# Altium schematic sheet MCU.SchDoc
size A3
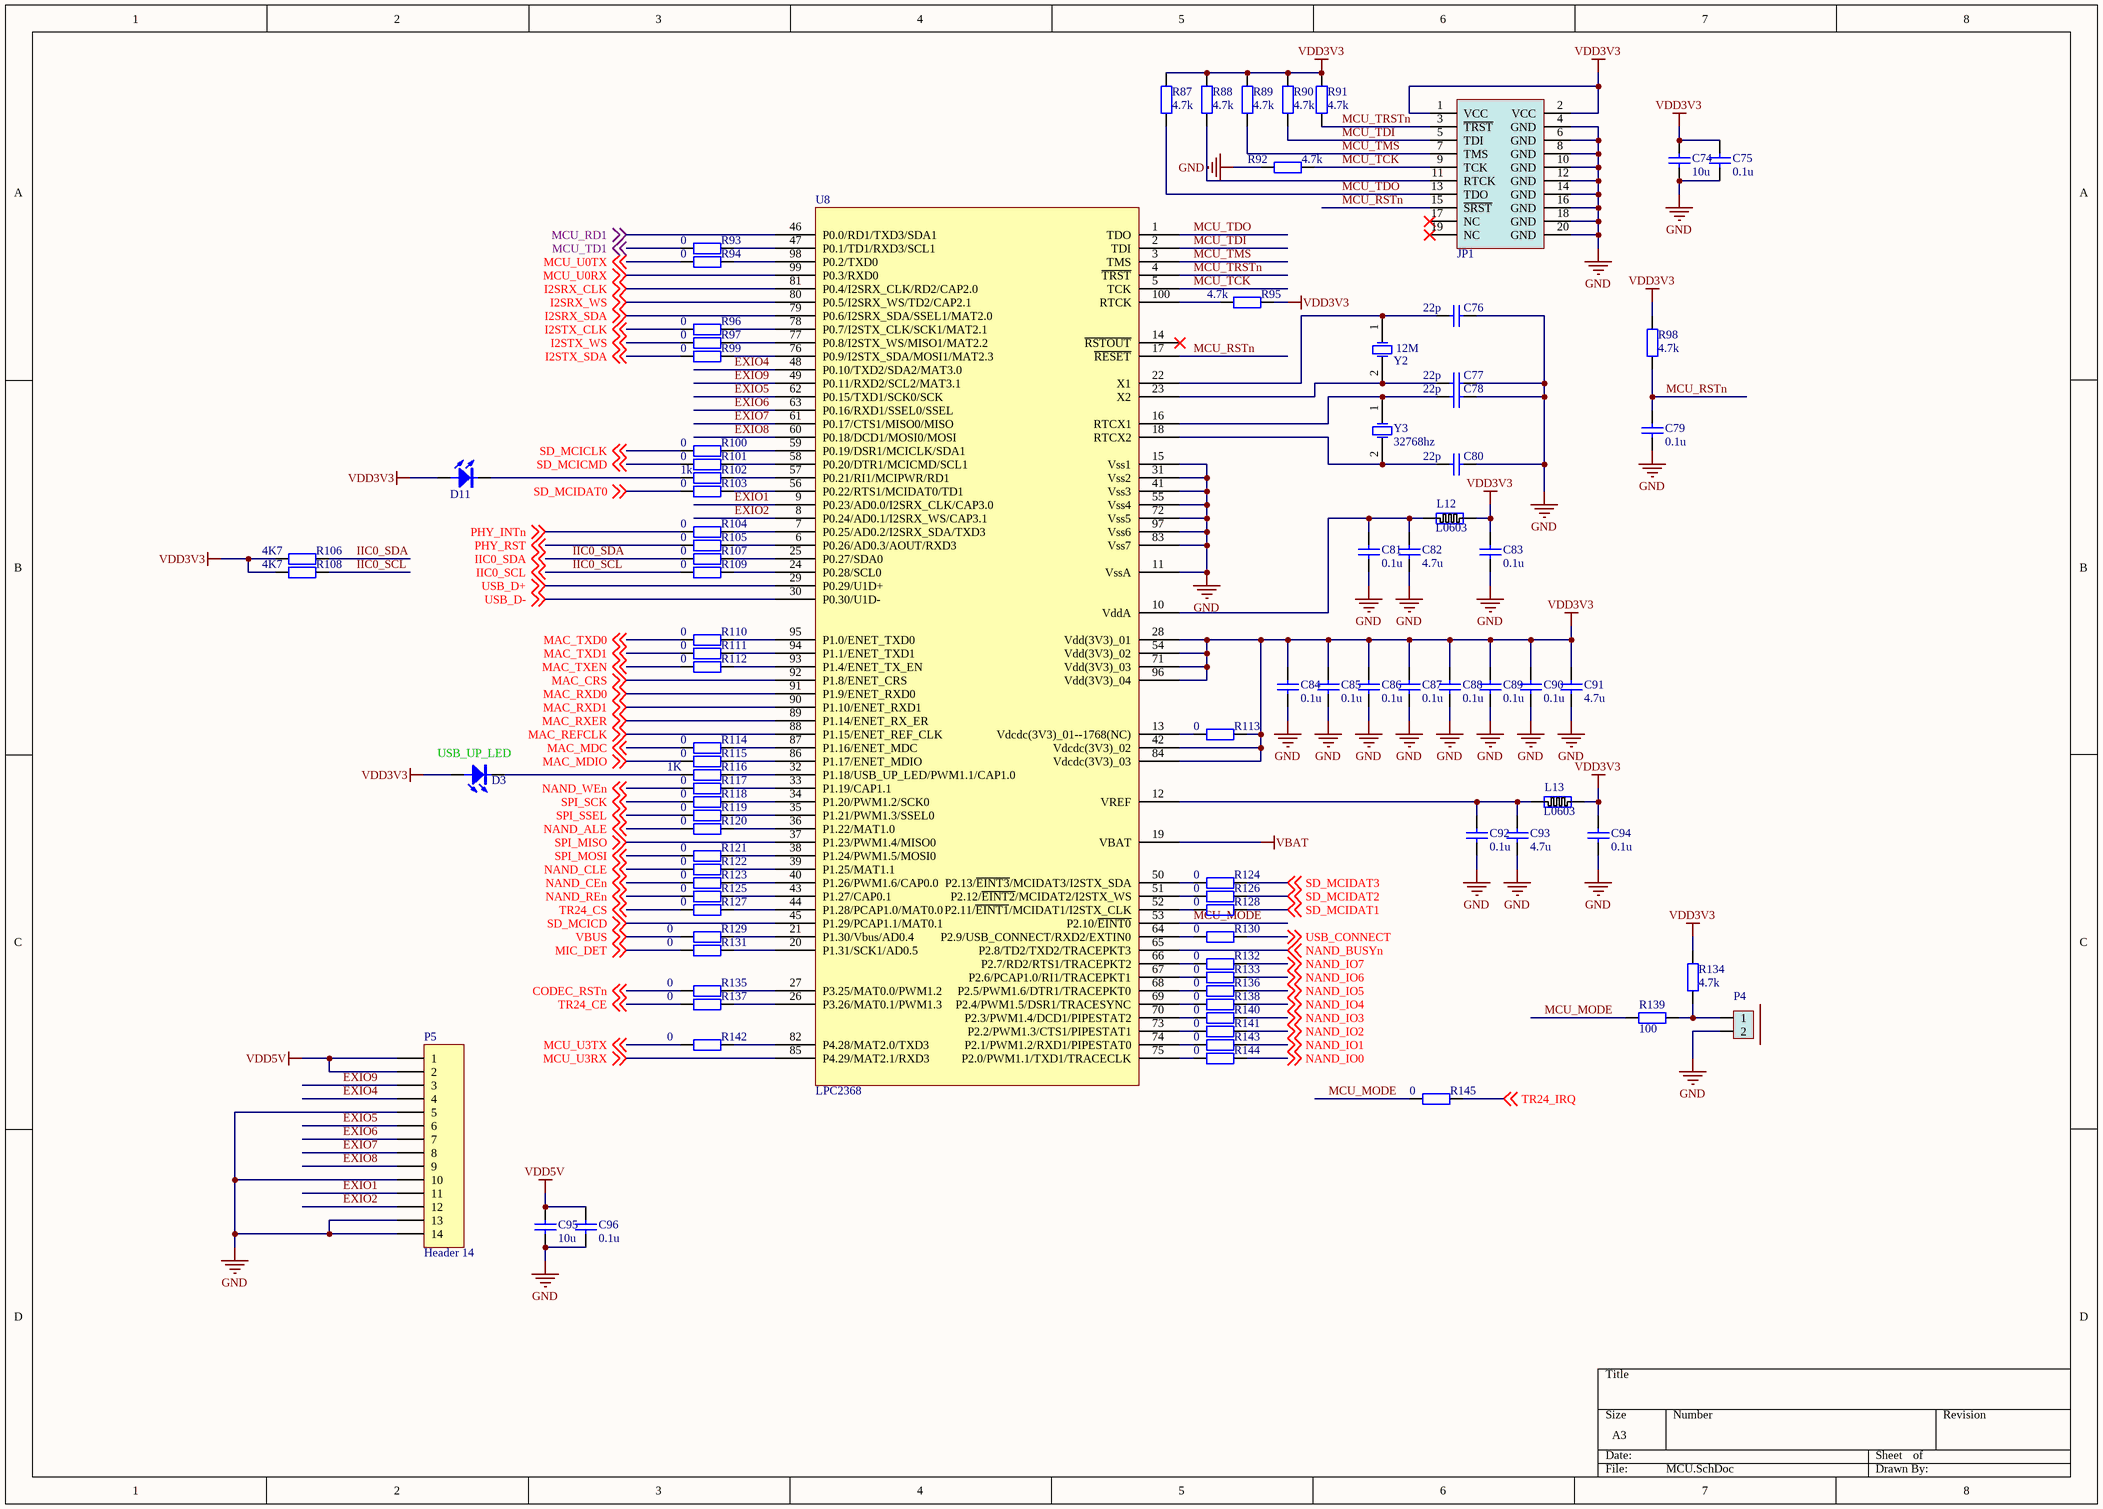
[diagram p0: MCU.SchDoc]

## Parts
C74  10u  [C0603]
C75  0.1u  [C0603]
C76  22p  [C0603]
C77  22p  [C0603]
C78  22p  [C0603]
C79  0.1u  [C0603]
C80  22p  [C0603]
C81  0.1u  [C0603]
C82  4.7u  [C0603]
C83  0.1u  [C0603]
C84  0.1u  [C0603]
C85  0.1u  [C0603]
C86  0.1u  [C0603]
C87  0.1u  [C0603]
C88  0.1u  [C0603]
C89  0.1u  [C0603]
C90  0.1u  [C0603]
C91  4.7u  [C0603]
C92  0.1u  [C0603]
C93  4.7u  [C0603]
C94  0.1u  [C0603]
C95  10u  [C0603]
C96  0.1u  [C0603]
D3  LED_SMT  [LED0805]  (value not drawn)
D11  LED_SMT  [LED0805]  (value not drawn)
JP1  JTAG20  [IDC-20(2.54)IDE]  (value not drawn)
L12  L0603  [L0603]
L13  L0603  [L0603]
P4  PIN  [SIP2]  (value not drawn)
P5  Header 14  [HDR1X14]
R87  4.7k  [R0603]
R88  4.7k  [R0603]
R89  4.7k  [R0603]
R90  4.7k  [R0603]
R91  4.7k  [R0603]
R92  4.7k  [R0603]
R93  0  [R0603]
R94  0  [R0603]
R95  4.7k  [R0603]
R96  0  [R0603]
R97  0  [R0603]
R98  4.7k  [R0603]
R99  0  [R0603]
R100  0  [R0603]
R101  0  [R0603]
R102  1k  [R0603]
R103  0  [R0603]
R104  0  [R0603]
R105  0  [R0603]
R106  4K7  [R0603]
R107  0  [R0603]
R108  4K7  [R0603]
R109  0  [R0603]
R110  0  [R0603]
R111  0  [R0603]
R112  0  [R0603]
R113  0  [R0603]
R114  0  [R0603]
R115  0  [R0603]
R116  1K  [R0603]
R117  0  [R0603]
R118  0  [R0603]
R119  0  [R0603]
R120  0  [R0603]
R121  0  [R0603]
R122  0  [R0603]
R123  0  [R0603]
R124  0  [R0603]
R125  0  [R0603]
R126  0  [R0603]
R127  0  [R0603]
R128  0  [R0603]
R129  0  [R0603]
R130  0  [R0603]
R131  0  [R0603]
R132  0  [R0603]
R133  0  [R0603]
R134  4.7k  [R0603]
R135  0  [R0603]
R136  0  [R0603]
R137  0  [R0603]
R138  0  [R0603]
R139  100  [R0603]
R140  0  [R0603]
R141  0  [R0603]
R142  0  [R0603]
R143  0  [R0603]
R144  0  [R0603]
R145  0  [R0603]
U8  LPC2368  [QFP100-I20-605605]
Y2  12M  [XTAL-SMD-LP]
Y3  32768hz  [XTAL32768]

## Nets
GND: C74.1 C75.1 C76.1 C77.1 C78.1 C79.1 C80.1 C81.1 C82.1 C83.1 C84.1 C85.1 C86.1 C87.1 C88.1 C89.1 C90.1 C91.1 C92.1 C93.1 C94.1 C95.1 C96.1 JP1.4(GND) JP1.6(GND) JP1.8(GND) JP1.10(GND) JP1.12(GND) JP1.14(GND) JP1.16(GND) JP1.18(GND) JP1.20(GND) P4.2 P5.5 P5.10 P5.13 P5.14 R92.2 U8.11(VssA) U8.15(Vss1) U8.31(Vss2) U8.41(Vss3) U8.55(Vss4) U8.72(Vss5) U8.83(Vss7) U8.97(Vss6)
VBAT: U8.19(VBAT)
VDD3V3: C74.2 C75.2 C83.2 C84.2 C85.2 C86.2 C87.2 C88.2 C89.2 C90.2 C91.2 C94.2 D3.A D11.A JP1.1(VCC) JP1.2(VCC) L12.2 L13.2 R87.2 R88.2 R89.2 R90.2 R91.2 R95.2 R98.2 R106.2 R108.2 R113.2 R134.2 U8.28(Vdd(3V3)_01) U8.42(Vdcdc(3V3)_02) U8.54(Vdd(3V3)_02) U8.71(Vdd(3V3)_03) U8.84(Vdcdc(3V3)_03) U8.96(Vdd(3V3)_04)
VDD5V: C95.2 C96.2 P5.1 P5.2
CODEC_RSTn: R135.1 ; off-sheet CODEC_RSTn
EXIO1: P5.11 U8.9(P0.23/AD0.0/I2SRX_CLK/CAP3.0)
EXIO2: P5.12 U8.8(P0.24/AD0.1/I2SRX_WS/CAP3.1)
EXIO4: P5.4 U8.48(P0.10/TXD2/SDA2/MAT3.0)
EXIO5: P5.6 U8.62(P0.15/TXD1/SCK0/SCK)
EXIO6: P5.7 U8.63(P0.16/RXD1/SSEL0/SSEL)
EXIO7: P5.8 U8.61(P0.17/CTS1/MISO0/MISO)
EXIO8: P5.9 U8.60(P0.18/DCD1/MOSI0/MOSI)
EXIO9: P5.3 U8.49(P0.11/RXD2/SCL2/MAT3.1)
I2SRX_CLK: U8.81(P0.4/I2SRX_CLK/RD2/CAP2.0) ; off-sheet I2SRX_CLK
I2SRX_SDA: U8.79(P0.6/I2SRX_SDA/SSEL1/MAT2.0) ; off-sheet I2SRX_SDA
I2SRX_WS: U8.80(P0.5/I2SRX_WS/TD2/CAP2.1) ; off-sheet I2SRX_WS
I2STX_CLK: R96.1 ; off-sheet I2STX_CLK
I2STX_SDA: R99.1 ; off-sheet I2STX_SDA
I2STX_WS: R97.1 ; off-sheet I2STX_WS
IIC0_SCL: R108.1 R109.1 ; off-sheet IIC0_SCL
IIC0_SDA: R106.1 R107.1 ; off-sheet IIC0_SDA
MAC_CRS: U8.92(P1.8/ENET_CRS) ; off-sheet MAC_CRS
MAC_MDC: R114.1 ; off-sheet MAC_MDC
MAC_MDIO: R115.1 ; off-sheet MAC_MDIO
MAC_REFCLK: U8.88(P1.15/ENET_REF_CLK) ; off-sheet MAC_REFCLK
MAC_RXD0: U8.91(P1.9/ENET_RXD0) ; off-sheet MAC_RXD0
MAC_RXD1: U8.90(P1.10/ENET_RXD1) ; off-sheet MAC_RXD1
MAC_RXER: U8.89(P1.14/ENET_RX_ER) ; off-sheet MAC_RXER
MAC_TXD0: R110.1 ; off-sheet MAC_TXD0
MAC_TXD1: R111.1 ; off-sheet MAC_TXD1
MAC_TXEN: R112.1 ; off-sheet MAC_TXEN
MCU_MODE: R139.2 R145.1 U8.53(P2.10/~{EINT0})
MCU_RD1: U8.46(P0.0/RD1/TXD3/SDA1) ; off-sheet MCU_RD1
MCU_RSTn: C79.2 JP1.15(~{SRST}) R98.1 U8.17(~{RESET})
MCU_TCK: JP1.9(TCK) R92.1 U8.5(TCK)
MCU_TD1: R93.1 ; off-sheet MCU_TD1
MCU_TDI: JP1.5(TDI) R90.1 U8.2(TDI)
MCU_TDO: JP1.13(TDO) R87.1 U8.1(TDO)
MCU_TMS: JP1.7(TMS) R89.1 U8.3(TMS)
MCU_TRSTn: JP1.3(~{TRST}) R91.1 U8.4(~{TRST})
MCU_U0RX: U8.99(P0.3/RXD0) ; off-sheet MCU_U0RX
MCU_U0TX: R94.1 ; off-sheet MCU_U0TX
MCU_U3RX: U8.85(P4.29/MAT2.1/RXD3) ; off-sheet MCU_U3RX
MCU_U3TX: R142.1 ; off-sheet MCU_U3TX
MIC_DET: R131.1 ; off-sheet MIC_DET
NAND_ALE: R120.1 ; off-sheet NAND_ALE
NAND_BUSYn: U8.65(P2.8/TD2/TXD2/TRACEPKT3) ; off-sheet NAND_BUSYn
NAND_CEn: R123.1 ; off-sheet NAND_CEn
NAND_CLE: R122.1 ; off-sheet NAND_CLE
NAND_IO0: R144.2 ; off-sheet NAND_IO0
NAND_IO1: R143.2 ; off-sheet NAND_IO1
NAND_IO2: R141.2 ; off-sheet NAND_IO2
NAND_IO3: R140.2 ; off-sheet NAND_IO3
NAND_IO4: R138.2 ; off-sheet NAND_IO4
NAND_IO5: R136.2 ; off-sheet NAND_IO5
NAND_IO6: R133.2 ; off-sheet NAND_IO6
NAND_IO7: R132.2 ; off-sheet NAND_IO7
NAND_REn: R125.1 ; off-sheet NAND_REn
NAND_WEn: R117.1 ; off-sheet NAND_WEn
PHY_INTn: R104.1 ; off-sheet PHY_INTn
PHY_RST: R105.1 ; off-sheet PHY_RST
SD_MCICD: U8.45(P1.29/PCAP1.1/MAT0.1) ; off-sheet SD_MCICD
SD_MCICLK: R100.1 ; off-sheet SD_MCICLK
SD_MCICMD: R101.1 ; off-sheet SD_MCICMD
SD_MCIDAT0: R103.1 ; off-sheet SD_MCIDAT0
SD_MCIDAT1: R128.2 ; off-sheet SD_MCIDAT1
SD_MCIDAT2: R126.2 ; off-sheet SD_MCIDAT2
SD_MCIDAT3: R124.2 ; off-sheet SD_MCIDAT3
SPI_MISO: U8.37(P1.23/PWM1.4/MISO0) ; off-sheet SPI_MISO
SPI_MOSI: R121.1 ; off-sheet SPI_MOSI
SPI_SCK: R118.1 ; off-sheet SPI_SCK
SPI_SSEL: R119.1 ; off-sheet SPI_SSEL
TR24_CE: R137.1 ; off-sheet TR24_CE
TR24_CS: R127.1 ; off-sheet TR24_CS
TR24_IRQ: R145.2 ; off-sheet TR24_IRQ
USB_CONNECT: R130.2 ; off-sheet USB_CONNECT
USB_D+: U8.29(P0.29/U1D+) ; off-sheet USB_D+
USB_D-: U8.30(P0.30/U1D-) ; off-sheet USB_D-
VBUS: R129.1 ; off-sheet VBUS
NetC76_2: C76.2 U8.22(X1) Y2.1(OSC1)
NetC77_2: C77.2 U8.23(X2) Y2.2(OSC2)
NetC78_2: C78.2 U8.16(RTCX1) Y3.1(OSC1)
NetC80_2: C80.2 U8.18(RTCX2) Y3.2(OSC2)
NetC81_2: C81.2 C82.2 L12.1 U8.10(VddA)
NetC92_2: C92.2 C93.2 L13.1 U8.12(VREF)
NetD3_K: D3.K R116.1
NetD11_K: D11.K R102.1
NetJP1_11: JP1.11(RTCK) R88.1
NetP4_1: P4.1 R134.1 R139.1
NetR93_2: R93.2 U8.47(P0.1/TD1/RXD3/SCL1)
NetR94_2: R94.2 U8.98(P0.2/TXD0)
NetR95_1: R95.1 U8.100(RTCK)
NetR96_2: R96.2 U8.78(P0.7/I2STX_CLK/SCK1/MAT2.1)
NetR97_2: R97.2 U8.77(P0.8/I2STX_WS/MISO1/MAT2.2)
NetR99_2: R99.2 U8.76(P0.9/I2STX_SDA/MOSI1/MAT2.3)
NetR100_2: R100.2 U8.59(P0.19/DSR1/MCICLK/SDA1)
NetR101_2: R101.2 U8.58(P0.20/DTR1/MCICMD/SCL1)
NetR102_2: R102.2 U8.57(P0.21/RI1/MCIPWR/RD1)
NetR103_2: R103.2 U8.56(P0.22/RTS1/MCIDAT0/TD1)
NetR104_2: R104.2 U8.7(P0.25/AD0.2/I2SRX_SDA/TXD3)
NetR105_2: R105.2 U8.6(P0.26/AD0.3/AOUT/RXD3)
NetR107_2: R107.2 U8.25(P0.27/SDA0)
NetR109_2: R109.2 U8.24(P0.28/SCL0)
NetR110_2: R110.2 U8.95(P1.0/ENET_TXD0)
NetR111_2: R111.2 U8.94(P1.1/ENET_TXD1)
NetR112_2: R112.2 U8.93(P1.4/ENET_TX_EN)
NetR113_1: R113.1 U8.13(Vdcdc(3V3)_01--1768(NC))
NetR114_2: R114.2 U8.87(P1.16/ENET_MDC)
NetR115_2: R115.2 U8.86(P1.17/ENET_MDIO)
NetR116_2: R116.2 U8.32(P1.18/USB_UP_LED/PWM1.1/CAP1.0)
NetR117_2: R117.2 U8.33(P1.19/CAP1.1)
NetR118_2: R118.2 U8.34(P1.20/PWM1.2/SCK0)
NetR119_2: R119.2 U8.35(P1.21/PWM1.3/SSEL0)
NetR120_2: R120.2 U8.36(P1.22/MAT1.0)
NetR121_2: R121.2 U8.38(P1.24/PWM1.5/MOSI0)
NetR122_2: R122.2 U8.39(P1.25/MAT1.1)
NetR123_2: R123.2 U8.40(P1.26/PWM1.6/CAP0.0)
NetR124_1: R124.1 U8.50(P2.13/~{EINT3}/MCIDAT3/I2STX_SDA)
NetR125_2: R125.2 U8.43(P1.27/CAP0.1)
NetR126_1: R126.1 U8.51(P2.12/~{EINT2}/MCIDAT2/I2STX_WS)
NetR127_2: R127.2 U8.44(P1.28/PCAP1.0/MAT0.0)
NetR128_1: R128.1 U8.52(P2.11/~{EINT1}/MCIDAT1/I2STX_CLK)
NetR129_2: R129.2 U8.21(P1.30/Vbus/AD0.4)
NetR130_1: R130.1 U8.64(P2.9/USB_CONNECT/RXD2/EXTIN0)
NetR131_2: R131.2 U8.20(P1.31/SCK1/AD0.5)
NetR132_1: R132.1 U8.66(P2.7/RD2/RTS1/TRACEPKT2)
NetR133_1: R133.1 U8.67(P2.6/PCAP1.0/RI1/TRACEPKT1)
NetR135_2: R135.2 U8.27(P3.25/MAT0.0/PWM1.2)
NetR136_1: R136.1 U8.68(P2.5/PWM1.6/DTR1/TRACEPKT0)
NetR137_2: R137.2 U8.26(P3.26/MAT0.1/PWM1.3)
NetR138_1: R138.1 U8.69(P2.4/PWM1.5/DSR1/TRACESYNC)
NetR140_1: R140.1 U8.70(P2.3/PWM1.4/DCD1/PIPESTAT2)
NetR141_1: R141.1 U8.73(P2.2/PWM1.3/CTS1/PIPESTAT1)
NetR142_2: R142.2 U8.82(P4.28/MAT2.0/TXD3)
NetR143_1: R143.1 U8.74(P2.1/PWM1.2/RXD1/PIPESTAT0)
NetR144_1: R144.1 U8.75(P2.0/PWM1.1/TXD1/TRACECLK)

Not connected (* = marked no-connect by the designer): JP1 17(NC)* 19(NC)*; U8 14(~{RSTOUT})*

## Notes on the sheet
- (near D3) USB_UP_LED

## Library data of the parts
C74-C96 = CAP0603: 0603 Capacitor without Polarity
D3 D11 = LED_SMT: 贴片发光二极管
JP1 = JTAG20: JLINK-Interface
L12 L13 = L0603: 0603 Inductor
P4 = SIP2: Connectors with two pins
P5 = Header 14: Header, 14-Pin; LatestRevisionDate: 17-Jul-2002; LatestRevisionNote: Re-released for DXP Platform.; Publisher: Altium Limited
R87-R145 = RES0603: 0603 Resistor
Y2 = XTAL: 2Pin晶振
Y3 = XTAL32768: 2Pin晶振